# EAGLE design ESP32_Metal_Detector_v1.0 (EAGLE 8.1.1)
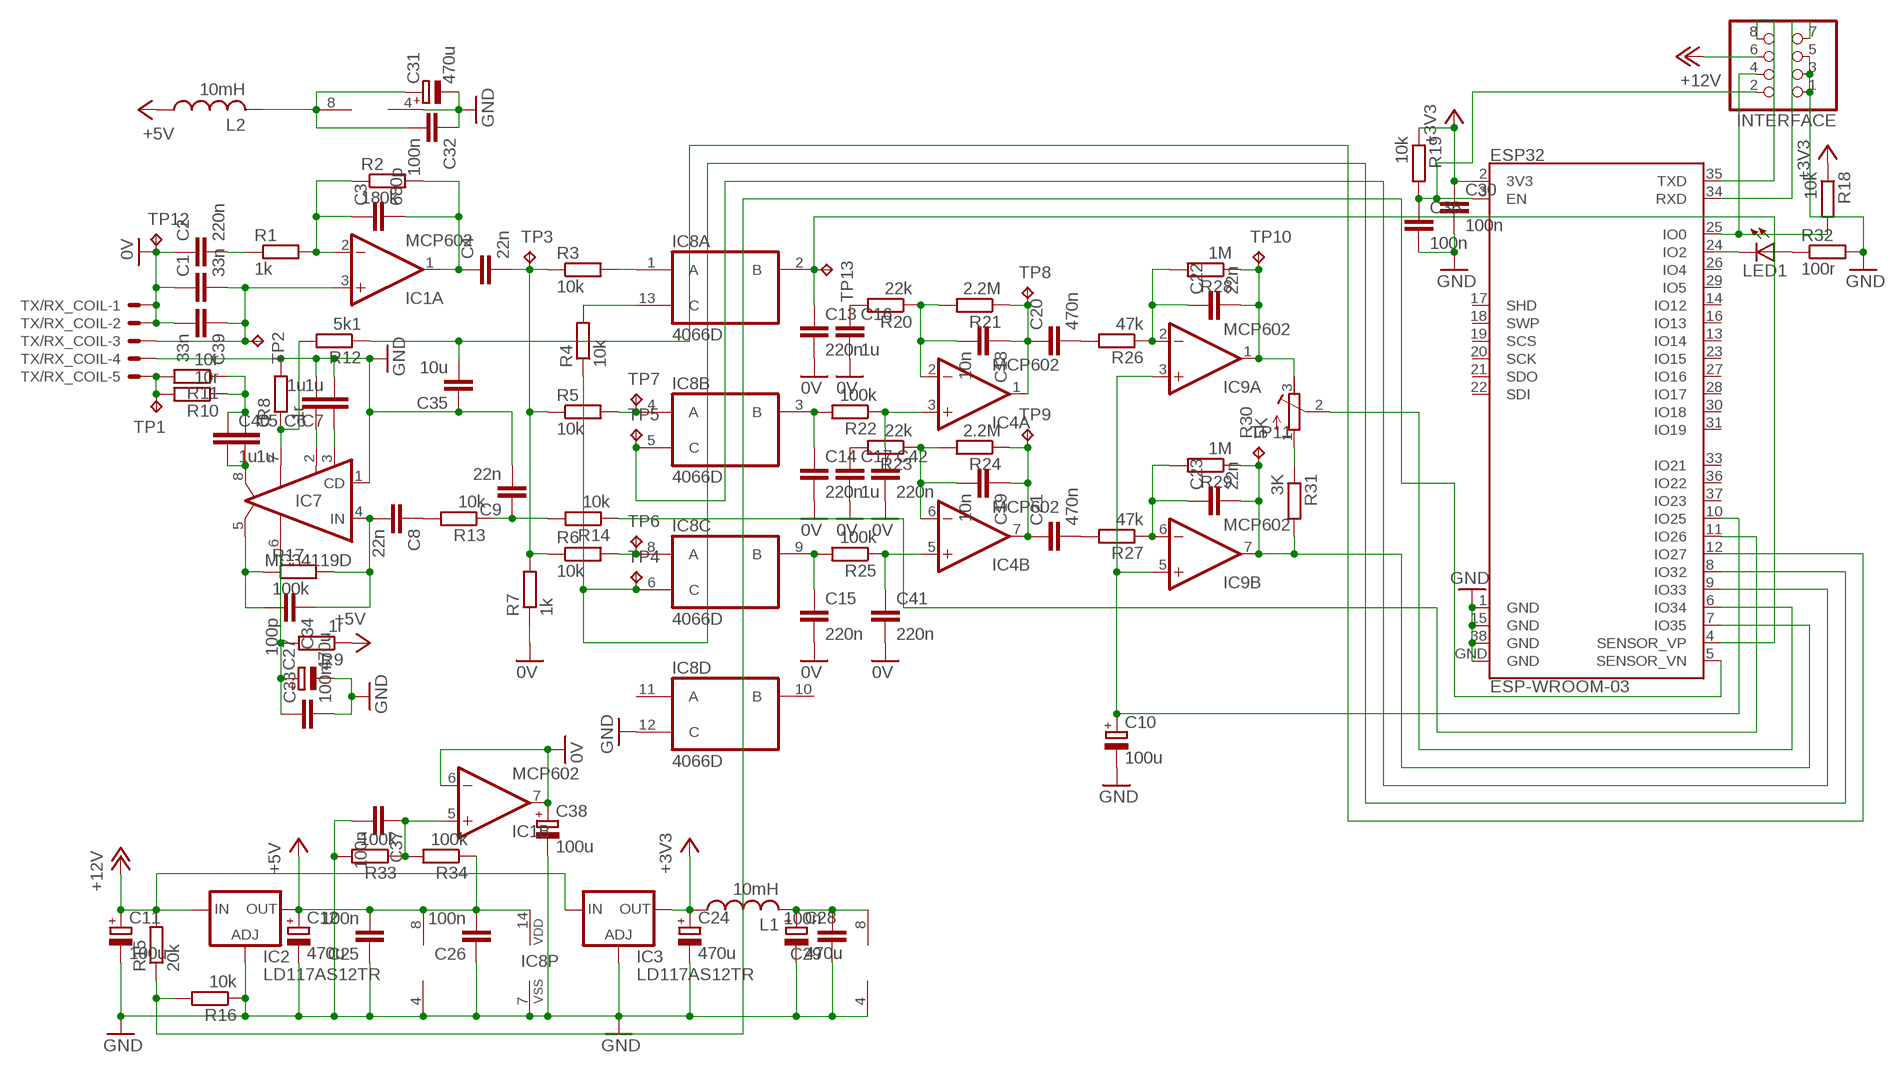
[diagram p0: schematic, sheet 1]

## Parts
C1  33n  C-EU050-055X075  [C050-055X075]
C2  220n  C-EUC1206  [C1206]
C3  680p  C-EUC1206  [C1206]
C4  22n  C-EUC1206  [C1206]
C5  1u  C-EU050-055X075  [C050-055X075]
C6  1u  C-EUC1206  [C1206]
C7  1u  C-EUC1206  [C1206]
C8  22n  C-EUC1206  [C1206]
C9  22n  C-EUC1206  [C1206]
C10  100u  CPOL-EUSMCB  [SMC_B]
C11  100u  CPOL-EUSMCE  [SMC_E]
C12  470u  CPOL-EUSMCD  [SMC_D]
C13  220n  C-EUC1206  [C1206]
C14  220n  C-EUC1206  [C1206]
C15  220n  C-EUC1206  [C1206]
C16  1u  C-EUC1206  [C1206]
C17  1u  C-EUC1206  [C1206]
C18  10n  C-EUC1206  [C1206]
C19  10n  C-EUC1206  [C1206]
C20  470n  C-EUC1206  [C1206]
C21  470n  C-EUC1206  [C1206]
C22  22n  C-EUC1206  [C1206]
C23  22n  C-EUC1206  [C1206]
C24  470u  CPOL-EUSMCD  [SMC_D]
C25  100n  C-EUC1206  [C1206]
C26  100n  C-EUC1206  [C1206]
C27  470u  CPOL-EUSMCD  [SMC_D]
C28  470u  CPOL-EUSMCD  [SMC_D]
C29  100n  C-EUC1206  [C1206]
C30  100n  C-EUC1206  [C1206]
C31  470u  CPOL-EUSMCD  [SMC_D]
C32  100n  C-EUC1206  [C1206]
C33  100n  C-EUC1206  [C1206]
C34  100p  C-EUC1206  [C1206]
C35  10u  C-EUC1206  [C1206]
C36  100n  C-EUC1206  [C1206]
C37  100n  C-EUC1206  [C1206]
C38  100u  CPOL-EUSMCB  [SMC_B]
C39  33n  C-EUC1206  [C1206]
C40  1u  C-EUC1206  [C1206]
C41  220n  C-EUC1206  [C1206]
C42  220n  C-EUC1206  [C1206]
ESP32  ESP-WROOM-03  [ESP-WROOM-03]
IC1  MCP602  LM393D  [SO08]
IC2  LD117AS12TR  [SOT223]
IC3  LD117AS12TR  [SOT223]
IC4  MCP602  LM393D  [SO08]
IC7  MC34119D  [SO08]
IC8  4066D  [SO14]
IC9  MCP602  LM393D  [SO08]
INTERFACE  PINHD-2X4  [2X04]
L1  10mH  L-USL5650M  [L5650M]
L2  10mH  L-USL5650M  [L5650M]
LED1  LEDSML1206  [SML1206]
R1  1k  R-EU_R1206  [R1206]
R2  180k  R-EU_R1206  [R1206]
R3  10k  R-EU_R1206  [R1206]
R4  10k  R-EU_R1206  [R1206]
R5  10k  R-EU_R1206  [R1206]
R6  10k  R-EU_R1206  [R1206]
R7  1k  R-EU_R1206  [R1206]
R8  1r  R-EU_R1206  [R1206]
R9  1r  R-EU_R1206  [R1206]
R10  10r  R-EU_R1206  [R1206]
R11  10r  R-EU_R1206  [R1206]
R12  5k1  R-EU_R1206  [R1206]
R13  10k  R-EU_R1206  [R1206]
R14  10k  R-EU_R1206  [R1206]
R15  20k  R-EU_R1206  [R1206]
R16  10k  R-EU_R1206  [R1206]
R17  100k  R-EU_R1206  [R1206]
R18  10k  R-EU_R1206  [R1206]
R19  10k  R-EU_R1206  [R1206]
R20  22k  R-EU_R1206  [R1206]
R21  2.2M  R-EU_R1206  [R1206]
R22  100k  R-EU_R1206  [R1206]
R23  22k  R-EU_R1206  [R1206]
R24  2.2M  R-EU_R1206  [R1206]
R25  100k  R-EU_R1206  [R1206]
R26  47k  R-EU_R1206  [R1206]
R27  47k  R-EU_R1206  [R1206]
R28  1M  R-EU_R1206  [R1206]
R29  1M  R-EU_R1206  [R1206]
R30  5K  R-TRIMM4G/J  [RTRIM4G/J]
R31  3K  R-EU_R1206  [R1206]
R32  100r  R-EU_R1206  [R1206]
R33  100k  R-EU_R1206  [R1206]
R34  100k  R-EU_R1206  [R1206]
TP1  TPPAD1-13  [P1-13]
TP2  TPPAD1-13  [P1-13]
TP3  TPPAD1-13  [P1-13]
TP4  TPPAD1-13  [P1-13]
TP5  TPPAD1-13  [P1-13]
TP6  TPPAD1-13  [P1-13]
TP7  TPPAD1-13  [P1-13]
TP8  TPPAD1-13  [P1-13]
TP9  TPPAD1-13  [P1-13]
TP10  TPPAD1-13  [P1-13]
TP11  TPPAD1-13  [P1-13]
TP12  TPPAD1-13  [P1-13]
TP13  TPPAD1-13  [P1-13]
TX/RX_COIL  22-23-2051  [22-23-2051]

## Nets
0V: C1.1 C2.1 C13.2 C14.2 C15.2 C16.2 C17.2 C38.+ C39.2 C41.2 C42.2 IC1.6(B:-IN) IC1.7(B:OUT) R7.1 TP12.TP TX/RX_COIL.1 TX/RX_COIL.2
+3V3: C24.+ C30.1 ESP32.2(3V3) IC3.4(OUT) L1.1 R18.1 R19.1
+5V: C12.+ C25.2 C26.2 IC2.4(OUT) IC4.8(P:V+) IC8.14(P:VDD) L2.1 R9.1 R34.1
+12V: C11.+ IC2.3(IN) IC3.3(IN) INTERFACE.6 R15.2
GND: C6.2 C7.2 C9.2 C10.- C11.- C12.- C24.- C25.1 C26.1 C27.- C28.- C29.1 C30.2 C31.- C32.1 C33.2 C35.1 C36.2 C37.2 C38.- ESP32.1(GND) ESP32.15(GND) ESP32.38(GND) ESP32.GND IC1.4(P:V-) IC2.1(ADJ) IC3.1(ADJ) IC4.4(P:V-) IC7.1(CD) IC8.7(P:VSS) IC8.12(D:C) IC9.4(P:V-) INTERFACE.1 INTERFACE.3 INTERFACE.5 R8.2 R16.1 R32.2 R33.2 TX/RX_COIL.4
N$1: C3.2 C4.1 IC1.1(A:OUT) R2.2
N$2: R30.1(A) R31.1
N$3: C1.2 C39.1 IC1.3(A:+IN) TP2.TP TX/RX_COIL.3
N$4: C2.2 R1.1
N$5: C3.1 IC1.2(A:-IN) R1.2 R2.1
N$6: ESP32.8(IO32) IC8.6(C:C) R4.1 TP4.TP
N$7: IC8.1(A:A) R3.2
N$8: IC8.8(C:A) R6.2 TP6.TP
N$9: C4.2 R3.1 R5.1 R6.1 R7.2 TP3.TP
N$10: C22.2 IC9.1(A:OUT) R28.1 R30.3(E) TP10.TP
N$11: IC8.13(A:C) R4.2
N$12: C5.2 C40.2 IC7.8(VO2)
N$13: C5.1 C40.1 R10.1 R11.1
N$14: C15.1 IC8.9(C:B) R25.2
N$15: C27.+ C33.1 IC7.6(VCC) R9.2
N$16: IC7.7(GND) R8.1 R12.2
N$17: C6.1 IC7.2(FC2)
N$18: C7.1 IC7.3(FC1)
N$19: C8.2 C34.1 IC7.4(IN) R17.2
N$20: C8.1 R13.2
N$21: C9.1 R13.1 R14.2
N$22: ESP32.11(IO26) R14.1
N$23: C28.+ C29.2 IC9.8(P:V+) L1.2
N$24: IC8.4(B:A) R5.2 TP7.TP
N$25: C14.1 IC8.3(B:B) R22.2
N$26: ESP32.5(SENSOR_VN) R15.1 R16.2
N$27: ESP32.9(IO33) IC8.5(B:C) TP5.TP
N$28: ESP32.6(IO34) R30.2(S)
N$29: C13.1 ESP32.4(SENSOR_VP) IC8.2(A:B) TP13.TP
N$30: C31.+ C32.2 IC1.8(P:V+) L2.2
N$31: C34.2 IC7.5(VO1) R17.1
N$32: C18.1 C20.1 IC4.1(A:OUT) R21.1 TP8.TP
N$33: C18.2 IC4.2(A:-IN) R20.1 R21.2
N$34: C19.2 IC4.6(B:-IN) R23.1 R24.2
N$35: C35.2 ESP32.12(IO27) R12.1
N$36: C42.1 IC4.3(A:+IN) R22.1
N$37: C41.1 IC4.5(B:+IN) R25.1
N$38: C20.2 R26.2
N$39: C21.2 R27.2
N$40: C23.1 IC9.6(B:-IN) R27.1 R29.2
N$41: C22.1 IC9.2(A:-IN) R26.1 R28.2
N$42: ESP32.25(IO0) INTERFACE.4 R18.2
N$43: C23.2 ESP32.7(IO35) IC9.7(B:OUT) R29.1 R31.2 TP11.TP
N$44: C10.+ ESP32.10(IO25) IC9.3(A:+IN) IC9.5(B:+IN)
N$45: C19.1 C21.1 IC4.7(B:OUT) R24.1 TP9.TP
N$46: LED1.A R32.1
N$47: C36.1 ESP32.3(EN) INTERFACE.2 R19.2
N$48: C16.1 R20.2
N$49: C17.1 R23.2
N$50: R10.2 R11.2 TP1.TP TX/RX_COIL.5
N$51: ESP32.24(IO2) LED1.C
N$52: C37.1 IC1.5(B:+IN) R33.1 R34.2
N$53: ESP32.35(TXD) INTERFACE.8
N$54: ESP32.34(RXD) INTERFACE.7
Unconnected: ESP32.13(IO14) ESP32.14(IO12) ESP32.16(IO13) ESP32.17(SHD) ESP32.18(SWP) ESP32.19(SCS) ESP32.20(SCK) ESP32.21(SDO) ESP32.22(SDI) ESP32.23(IO15) ESP32.26(IO4) ESP32.27(IO16) ESP32.28(IO17) ESP32.29(IO5) ESP32.30(IO18) ESP32.31(IO19) ESP32.33(IO21) ESP32.36(IO22) ESP32.37(IO23) IC8.10(D:B) IC8.11(D:A)

## Library data of the parts
C1 C5 = rcl:C-EU: CAPACITOR, European symbol
C2-C4 C6-C9 C13-C23 C25 C26 C29 C30 C32-C37 C39-C42 = resistor:C-EU: CAPACITOR, European symbol
C10-C12 C24 C27 C28 C31 C38 = rcl:CPOL-EU: POLARIZED CAPACITOR, European symbol
ESP32 = esp32:ESP-WROOM-03
IC1 IC4 IC9 = linear:LM393: COMPARATOR
IC2 IC3 = v-reg:LD117A?*: Low drop fixed and adjustable positive voltage regulators 1 A Source: http://www.st.com/stonline/products/literature/ds/7194/ld1117axx.pdf
IC7 = linear:MC34119: Low Power Audio Amplifier Motorola
IC8 = 40xx:4066: Quad bilateral ANALOG SWITCH
INTERFACE = pinhead:PINHD-2X4: PIN HEADER
L1 L2 = rcl:L-US: INDUCTOR, American symbol
LED1 = led:LED: LED OSRAM: - CHIPLED LG R971, LG N971, LY N971, LG Q971, LY Q971, LO R971, LY R971 LH N974, LH R974 LS Q976, LO Q976, LY Q976 LO Q996 - Hyper CHIPLED LW Q18S LB Q993, LB Q99A, LB R99A - SideLED LS A670, LO A670, LY A670, LG A670, LP A670 LB A673, LV A673, LT A673, LW A673 LH A674 LY A675 LS A676, LA A676, LO A676, LY A676, LW A676 LS A679, LY A679, LG A679 - Hyper Micro SIDELED® LS Y876, LA Y876, LO Y876, LY Y876 LT Y87S - SmartLED LW L88C, LW L88S LB L89C, LB L89S, LG L890 LS L89K, LO L89K, LY L89K LS L896, LA L896, LO L896, LY L896 - TOPLED LS T670, LO T670, LY T670, LG T670, LP T670 LSG T670, LSP T670, LSY T670, LOP T670, LYG T670 LG T671, LOG T671, LSG T671 LB T673, LV T673, LT T673, LW T673 LH T674 LS T676, LA T676, LO T676, LY T676, LB T676, LH T676, LSB T676, LW T676 LB T67C, LV T67C, LT T67C, LS T67K, LO T67K, LY T67K, LW E67C LS E67B, LA E67B, LO E67B, LY E67B, LB E67C, LV E67C, LT E67C LW T67C LS T679, LY T679, LG T679 LS T770, LO T770, LY T770, LG T770, LP T770 LB T773, LV T773, LT T773, LW T773 LH T774 LS E675, LA E675, LY E675, LS T675 LS T776, LA T776, LO T776, LY T776, LB T776 LHGB T686 LT T68C, LB T68C - Hyper Mini TOPLED® LB M676 - Mini TOPLED Santana® LG M470 LS M47K, LO M47K, LY M47K Source: http://www.osram.convergy.de LUXEON: - LUMILED® LXK2-PW12-R00, LXK2-PW12-S00, LXK2-PW14-U00, LXK2-PW14-V00 LXK2-PM12-R00, LXK2-PM12-S00, LXK2-PM14-U00 LXK2-PE12-Q00, LXK2-PE12-R00, LXK2-PE12-S00, LXK2-PE14-T00, LXK2-PE14-U00 LXK2-PB12-K00, LXK2-PB12-L00, LXK2-PB12-M00, LXK2-PB14-N00, LXK2-PB14-P00, LXK2-PB14-Q00 LXK2-PR12-L00, LXK2-PR12-M00, LXK2-PR14-Q00, LXK2-PR14-R00 LXK2-PD12-Q00, LXK2-PD12-R00, LXK2-PD12-S00 LXK2-PH12-R00, LXK2-PH12-S00 LXK2-PL12-P00, LXK2-PL12-Q00, LXK2-PL12-R00 Source: www.luxeon.com KINGBRIGHT: KA-3528ASYC Source: www.kingbright.com
R1-R29 R31-R34 = resistor:R-EU_: RESISTOR, European symbol
R30 = rcl:R-TRIMM: Trimm resistor
TP1-TP13 = testpad:TP: Test pad
TX/RX_COIL = con-molex:22-23-2051: .100" (2.54mm) Center Header - 5 Pin; MF: MOLEX; MPN: 22-23-2051; OC_FARNELL: 1462952; OC_NEWARK: 38C9178

## Board
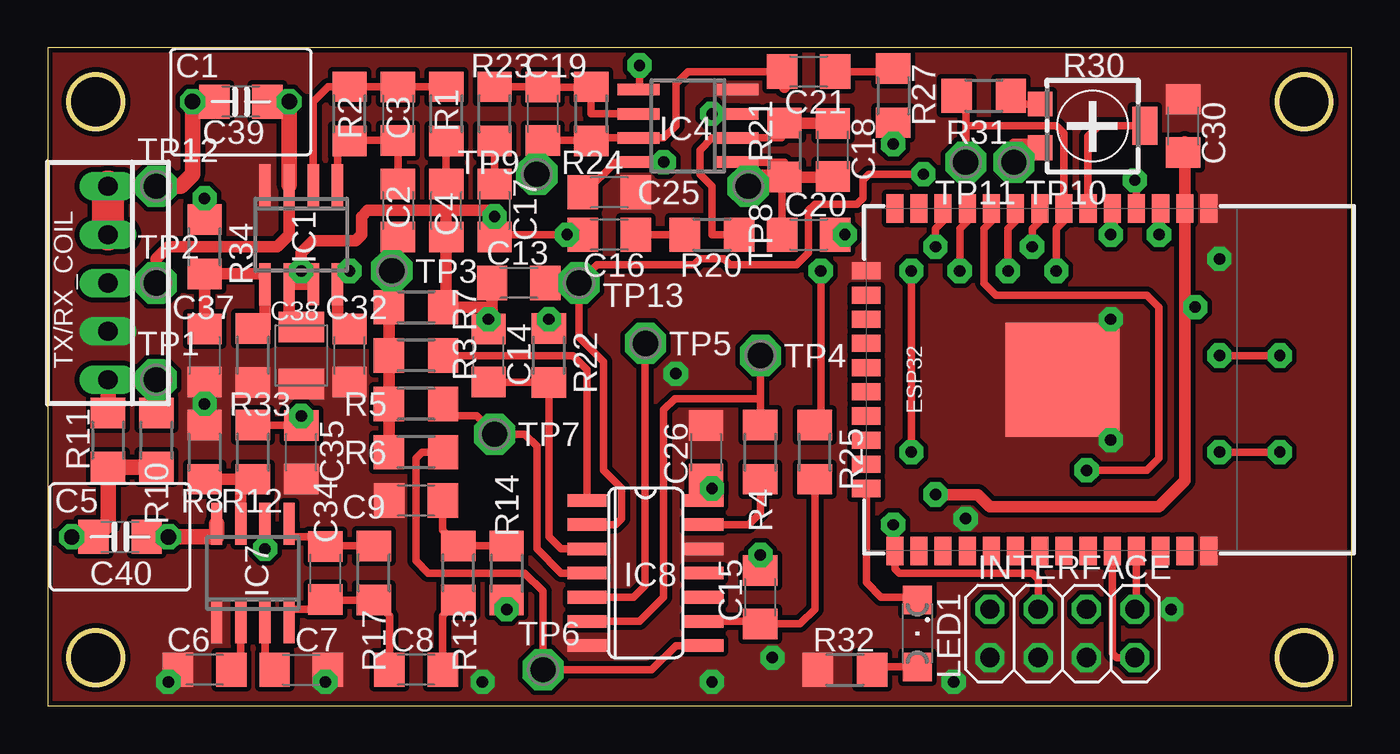
[diagram p1: board, top side]
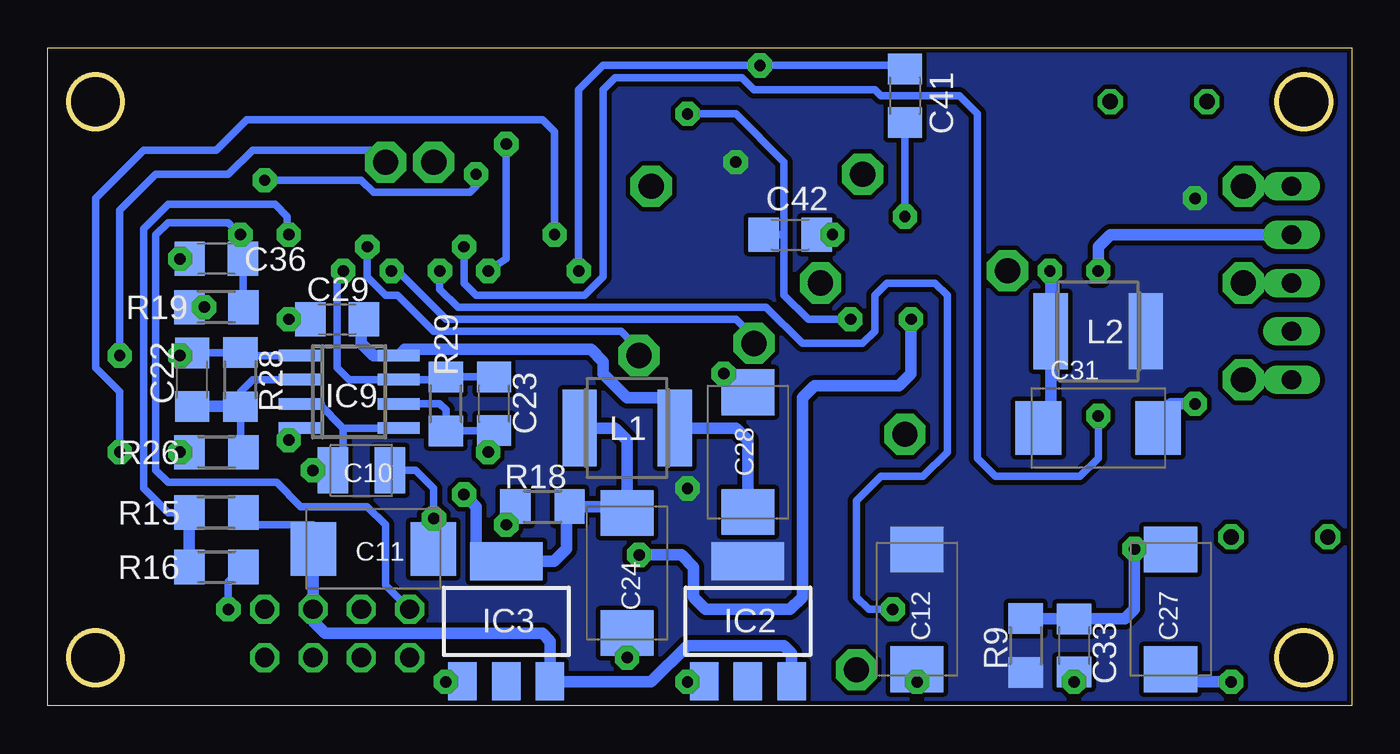
[diagram p2: board, bottom side, seen from below]

Size 68.56 x 34.59 mm. Coordinates in mm from the lower left corner, seen from the top.
Outline: 0,0 68.56,0 68.56,34.59 0,34.59 0,0
Outline: circle at 2.54,2.54 radius 1.42
Outline: circle at 66.04,2.54 radius 1.42
Outline: circle at 66.04,31.75 radius 1.42
Outline: circle at 2.54,31.75 radius 1.42
Copper layers (1*16): Top 0.035mm / dielectric 1.5mm / Bottom 0.035mm
Design rules "ITEADstudio_DRC": minimum track width 6mil, minimum drill 12mil, track to track 6mil, track to pad 6mil, pad to pad 6mil, via to via 6mil, smd to smd 0mil, copper to edge 10mil, drill to drill 10mil, minimum pad ring 10mil, minimum via ring 6mil, stop-mask expansion 2mil, vias tented up to drill 100mil, thermal gap 10mil

### Footprints (pad centres in the part's own frame; a part is rotated, then mirrored left to right if it is on the bottom)
C050-055X075 = drill 0.813 octagon: 1 -2.54,0; 2 2.54,0
C1206 = smd 1.6 x 1.8: 1 -1.4,0; 2 1.4,0
SMC_B = smd 1.6 x 2.4: + -1.5,0; - 1.5,0
SMC_E = smd 2.4 x 2.8: + -3.15,0; - 3.15,0
SMC_D = smd 2.4 x 2.8: + -3.15,0; - 3.15,0
ESP-WROOM-03 = smd 0.9 x 1.5: 1 7.7,9; 2 6.43,9; 3 5.16,9; 4 3.89,9; 5 2.62,9; 6 1.35,9; 7 0.08,9; 8 -1.19,9; 9 -2.46,9; 10 -3.73,9; 11 -5,9; 12 -6.27,9; 13 -7.54,9; 14 -8.81,9; 25 -8.81,-9; 26 -7.54,-9; 27 -6.27,-9; 28 -5,-9; 29 -3.73,-9; 30 -2.46,-9; 31 -1.19,-9; 32 0.08,-9; 33 1.35,-9; 34 2.62,-9; 35 3.89,-9; 36 5.16,-9; 37 6.43,-9; 38 7.7,-9 | smd 1.5 x 0.9: 15 -10.3,5.715; 16 -10.3,4.445; 17 -10.3,3.175; 18 -10.3,1.905; 19 -10.3,0.635; 20 -10.3,-0.635; 21 -10.3,-1.905; 22 -10.3,-3.175; 23 -10.3,-4.445; 24 -10.3,-5.715 | smd 6 x 6: GND 0,0
SO08 = smd 0.6 x 2.2: 1 -1.905,-2.6; 2 -0.635,-2.6; 3 0.635,-2.6; 4 1.905,-2.6; 5 1.905,2.6; 6 0.635,2.6; 7 -0.635,2.6; 8 -1.905,2.6
SOT223 = smd 1.5 x 2: 1 -2.3,-3.15; 2 0,-3.15; 3 2.3,-3.15 | smd 3.8 x 2: 4 0,3.15
SO14 = smd 0.66 x 2.032: 1 -3.81,-3.073; 2 -2.54,-3.073; 3 -1.27,-3.073; 4 0,-3.073; 5 1.27,-3.073; 6 2.54,-3.073; 7 3.81,-3.073; 8 3.81,3.073; 9 2.54,3.073; 10 1.27,3.073; 11 0,3.073; 12 -1.27,3.073; 13 -2.54,3.073; 14 -3.81,3.073
2X04 = drill 1.016 octagon: 1 -3.81,-1.27; 2 -3.81,1.27; 3 -1.27,-1.27; 4 -1.27,1.27; 5 1.27,-1.27; 6 1.27,1.27; 7 3.81,-1.27; 8 3.81,1.27
L5650M = smd 1.8 x 4: 1 -2.5,0; 2 2.5,0
SML1206 = smd 1.5 x 1.5: A 1.75,0; C -1.75,0
R1206 = smd 1.6 x 1.803: 1 -1.422,0; 2 1.422,0
RTRIM4G/J = smd 1.3 x 1.3: 1 -1.15,-2.75; 3 1.15,-2.75 | smd 2 x 1.3: 2 0,2.75
P1-13 = drill 1.321 pad 2.159 octagon: TP 0,0
22-23-2051 = drill 1 long: 1 -5.08,0; 2 -2.54,0; 3 0,0; 4 2.54,0; 5 5.08,0

### Placement (x,y rotation side)
C1  10.16,31.75 0 top
C2  20.95,26.04 90 top
C3  18.41,31.11 270 top
C4  18.41,26.04 270 top
C5  3.81,8.89 0 top
C6  8.26,1.91 180 top
C7  13.34,1.91 0 top
C8  19.37,1.91 180 top
C9  19.37,10.79 180 top
C10  52.07,12.38 0 bottom
C11  51.44,8.26 0 bottom
C12  22.86,5.08 270 bottom
C13  24.77,22.23 180 top
C14  23.18,18.41 90 top
C15  37.47,5.71 90 top
C16  29.53,24.77 180 top
C17  23.5,26.04 270 top
C18  41.27,29.21 90 top
C19  26.04,31.11 90 top
C20  40.01,24.77 0 top
C21  40.01,33.34 0 top
C22  60.96,17.14 90 bottom
C23  45.09,15.88 90 bottom
C24  38.1,6.99 270 bottom
C25  29.53,26.99 180 top
C26  34.61,13.34 270 top
C27  9.53,5.08 270 bottom
C28  31.75,13.34 90 bottom
C29  53.34,20.32 0 bottom
C30  59.69,30.48 90 top
C31  13.34,14.61 0 bottom
C32  15.88,18.41 90 top
C33  14.61,3.17 270 bottom
C34  14.61,6.99 90 top
C35  13.34,13.34 90 top
C36  59.69,23.5 180 bottom
C37  8.26,18.41 270 top
C38  13.34,18.41 270 top
C39  10.16,31.75 180 top
C40  3.81,8.89 0 top
C41  23.5,32.07 270 bottom
C42  29.53,24.77 0 bottom
ESP32  53.34,17.14 0 top
IC1  13.34,24.77 180 top
IC2  31.75,4.45 0 bottom
IC3  44.45,4.45 0 bottom
IC4  33.66,30.48 90 top
IC7  10.79,6.99 0 top
IC8  31.43,6.99 270 top
IC9  52.7,16.51 270 bottom
INTERFACE  53.34,3.81 0 top
L1  38.1,14.61 0 bottom
L2  13.34,19.68 180 bottom
LED1  45.72,3.81 270 top
R1  20.95,31.11 90 top
R2  15.88,31.11 270 top
R3  19.37,18.41 0 top
R4  37.47,13.34 270 top
R5  19.37,15.88 0 top
R6  19.37,13.34 0 top
R7  19.37,20.95 180 top
R8  8.26,13.34 90 top
R9  17.14,3.17 90 bottom
R10  5.71,13.97 90 top
R11  3.17,13.97 90 top
R12  10.79,13.34 270 top
R13  21.59,6.99 270 top
R14  24.13,6.99 90 top
R15  59.69,10.16 0 bottom
R16  59.69,7.3 180 bottom
R17  17.14,6.99 270 top
R18  42.55,10.48 180 bottom
R19  59.69,20.95 0 bottom
R20  34.92,24.77 180 top
R21  38.73,29.21 90 top
R22  26.35,18.41 270 top
R23  23.5,31.11 270 top
R24  28.57,31.11 90 top
R25  40.32,13.34 270 top
R26  59.69,13.34 180 bottom
R27  44.45,32.07 90 top
R28  58.42,17.14 270 bottom
R29  47.62,15.88 270 bottom
R30  54.93,30.48 270 top
R31  49.21,32.07 180 top
R32  41.91,1.91 180 top
R33  10.79,18.41 270 top
R34  8.26,24.13 270 top
TP1  5.71,17.14 0 top
TP2  5.71,22.23 0 top
TP3  18.1,22.86 0 top
TP4  37.47,18.41 0 top
TP5  31.43,19.05 0 top
TP6  26.04,1.91 0 top
TP7  23.5,14.29 0 top
TP8  36.83,27.3 0 top
TP9  25.72,27.94 90 top
TP10  50.8,28.57 90 top
TP11  48.26,28.57 90 top
TP12  5.71,27.3 0 top
TP13  27.94,22.23 0 top
TX/RX_COIL  3.17,22.23 270 top

### Tracks (layer width: path | path; a pad name or v marks a point on that pad's centre or on a via)
0V  (via drill 0.6 pad 1.27)
  Top 0.152: v23.18,20.32 23.36,21.59
  Top 0.406: v27.3,24.77 C42.2 23.62,24.77 arc90 C17.2
  Top 0.61: 21.11,25.12 arc90 C2.1 | 13.34,22.16 IC1.7 | 13.34,22.16 IC1.6 12.7,19.91 C38.+ | 13.34,22.16 v13.34,22.86 13.34,23.81 13.97,24.45 16.19,24.45 16.51,24.77 16.51,25.72 16.83,26.04 20.95,26.04 | 20.95,26.04 C2.1 | C13.2 23.36,21.59 23.36,20.95 | 23.36,20.95 23.36,20.58 C14.2 | C17.2 v23.5,25.72 23.5,26.04 20.95,26.04 | C15.2 v37.47,7.94 | 23.36,20.95 R7.1 20.95,21.12 C2.1
  Top 0.813: TX/RX_COIL.1 TP12.TP 6.99,27.3 7.62,27.94 C1.1 C39.2
  Top 1.676: TX/RX_COIL.2 TX/RX_COIL.1
  Bottom 0.406: C42.2 v27.3,24.77 | C41.2 v23.5,25.72
  Bottom 0.61: v13.34,22.86 13.34,24.13 12.7,24.77 TX/RX_COIL.2 | v23.18,20.32 23.18,17.46 23.81,16.83 28.26,16.83 28.89,16.19 28.89,5.71 29.53,5.08 33.97,5.08 34.61,5.71 34.61,7.3 35.24,7.94 v37.47,7.94
+3V3  (via drill 0.6 pad 1.27)
  Top 0.61: 59.77,21.51 ESP32.2 59.77,29.64 C30.1 | 59.77,21.51 v60.33,20.95 | 59.77,21.51 59.77,11.83 58.42,10.48 49.53,10.48 48.9,11.11 v46.67,11.11
  Bottom 0.61: R19.1 v60.33,20.95 | C24.+ 38.1,13.97 38.73,14.61 L1.1 40.64,14.56 40.64,13.97 | 38.12,10.16 C24.+ | C24.+ 38.44,10.48 R18.1 41.27,10.31 41.27,8.26 41.94,7.59 IC3.4 45.7,7.59 45.72,7.62 46.04,7.62 46.04,10.48 v46.67,11.11
+5V  (via drill 0.6 pad 1.27)
  Top 0.152: C26.2 35.05,11.3 v34.92,11.43 | IC4.8 v32.38,28.57
  Top 0.406: C25.2 28.26,26.99 29.84,28.57 IC4.8
  Top 0.61: R34.1 v8.26,26.67 | C26.2 34.92,11.21 IC8.14
  pour Bottom (isolate 0.254, no thermals): 0,34.29 68.58,34.29 68.58,0 0,0
+12V
  Bottom 0.406: R15.2 57.63,9.53 54.61,9.53 54.59,9.18 C11.+
  Bottom 0.61: IC2.3 29.45,2.78 29.84,3.17 34.92,3.17 36.83,1.27 42.12,1.27 IC3.3 42.15,3.42 42.55,3.81 53.98,3.81 54.61,4.45 INTERFACE.6 54.61,8.23 C11.+ 54.61,8.28
GND  (via drill 0.6 pad 1.27, 0.61 pad 1.27)
  Bottom 0.152: C33.2 14.61,1.91
  Bottom 0.406: v59.05,5.08 59.05,6.52 R16.1 | C10.- 49.21,12.38 48.26,11.43 v48.26,9.84
  Bottom 0.61: C36.2 v61.59,23.5 | C27.- 9.5,1.27 v6.35,1.27 | v8.26,15.88 9.53,15.88 10.19,15.21 C31.- | C12.- v22.86,1.27 | IC2.1 34.29,1.53 v34.92,1.27 | IC3.1 46.99,1.53 v47.62,1.27 | C28.- v33.02,17.46 | C24.- v38.1,2.54 | v14.61,1.27 C33.2 | v48.26,9.84 48.26,8.28 C11.- | IC9.4 55.94,14.03 v55.88,13.97 | C29.1 v55.88,20.32
  pour Top (isolate 0.254, no thermals): 0,34.29 0.64,34.29 68.58,34.29 68.58,0 0,0
N$1
  Top 0.406: 15.9,29.71 C3.2 C4.1 | R2.2 15.24,29.06 IC1.1
  Top 0.61: 15.9,29.71 R2.2
N$2
  Top 0.406: R30.1 50.92,31.63 50.48,32.07 50.48,32.22 R31.1
N$3
  Top 0.61: IC1.3 12.7,24.77 12.06,24.13 6.35,24.13 5.71,23.5 TP2.TP
  Top 0.813: IC1.3 C1.2 C39.1 | TP2.TP TX/RX_COIL.3
N$4
  Top 0.406: R1.1 C2.2
N$5
  Top 0.406: IC1.2 13.97,31.75 14.76,32.54 R2.1 18.39,32.54 | 18.44,32.54 R1.2
  Top 0.61: 18.39,32.54 C3.1 18.44,32.54
N$6  (via drill 0.6 pad 1.27)
  Top 0.406: 37.47,16.19 R4.1 | 37.47,16.19 TP4.TP | IC8.6 31.11,4.45 32.38,5.71 32.38,15.56 32.98,16.15 37.43,16.15 37.47,16.19 | ESP32.8 52.15,25.48 51.75,25.08 v51.75,24.13
  Top 0.61: 37.29,14.44 R4.1
  Bottom 0.406: TP4.TP 37.47,18.73 38.42,19.68 48.26,19.68 50.16,21.59 50.8,21.59 51.75,22.54 v51.75,24.13
N$7
  Top 0.406: IC8.1 28.36,17.68 27.62,18.41 R3.2
N$8
  Top 0.406: IC8.8 33.02,3.17 31.75,1.91 TP6.TP 26.04,6.03 25.08,6.99 20,6.99 19.37,7.62 19.37,13.02 19.68,13.34 R6.2
N$9
  Top 0.254: TP3.TP 18.26,23.5
  Top 0.61: C4.2 18.26,25.12 18.26,23.5 R7.2 R3.1 R5.1 R6.1
N$10  (via drill 0.6 pad 1.27)
  Top 0.406: v61.59,18.41 v64.77,18.41
  Top 0.61: R30.3 51.98,29.53 50.8,29.53 TP10.TP
  Bottom 0.406: IC9.1 58.27,18.41 | R28.1 60.94,18.57 | v64.77,18.41 64.77,26.04 62.87,27.94 59.05,27.94 57.78,29.21 51.44,29.21 TP10.TP
  Bottom 0.61: 58.27,18.41 R28.1 | 60.94,18.57 C22.2 61.47,18.55 v61.59,18.41
N$11
  Top 0.406: IC8.13 36.83,9.53 37.47,10.16 R4.2
N$12
  Top 0.813: IC7.8 8.89,8.89 C5.2 C40.2
N$13
  Top 0.813: R10.1 R11.1 3.17,9.53 2.54,8.89 C40.1 C5.1
N$14
  Top 0.406: IC8.9 37.02,4.45 C15.1 39.56,4.32 40.32,5.08 R25.2
N$15  (via drill 0.6 pad 1.27)
  Top 0.61: IC7.6 v11.43,8.26
  Bottom 0.61: C27.+ 9.55,8.26 v11.43,8.26 11.43,5.08 11.94,4.58 C33.1 17.12,4.58 R9.2
N$16
  Top 0.61: 10.16,11.91 R8.1 | 10.16,11.91 R12.2 | IC7.7 10.16,11.91
N$17
  Top 0.406: IC7.2 10.16,2.41 C6.1
N$18
  Top 0.406: IC7.3 11.43,2.41 C7.1
N$19
  Top 0.406: C8.2 17.97,4.74 R17.2 14.61,5.56 C34.1 14.61,5.08 12.7,5.08
  Top 0.61: 12.7,5.08 IC7.4 | R17.2 17.12,5.58
N$20
  Top 0.406: C8.1 20.77,4.74 R13.2
N$21
  Top 0.406: R14.2 R13.1 20.77,9.23 C9.1
  Top 0.61: R13.1 21.09,8.54
N$22  (via drill 0.6 pad 1.27)
  Top 0.406: ESP32.11 48.34,25.48 47.94,25.08 v47.94,22.86
  Top 0.61: v24.13,5.08 R14.1
  Bottom 0.406: v24.13,5.08 25.4,5.08 26.04,5.71 26.04,10.79 24.77,12.06 22.54,12.06 21.27,13.34 21.27,21.59 21.91,22.23 24.45,22.23 25.08,21.59 25.08,19.68 25.72,19.05 28.89,19.05 30.8,20.95 46.99,20.95 47.94,21.91 v47.94,22.86
N$23
  Bottom 0.61: C28.+ 31.75,13.97 32.38,14.61 L1.2 35.6,16.15 35.56,16.19 38.1,16.19 39.37,17.46 39.37,18.1 40.01,18.73 49.79,18.73 IC9.8 | 50.8,18.41 IC9.8 | 51.44,20.19 C29.2 52.07,20.19 52.07,19.05 51.44,18.41 IC9.8
N$24
  Top 0.406: 28.57,6.99 IC8.4 26.99,6.99 25.72,8.26 25.72,13.65 25.08,14.29 TP7.TP 22.54,15.24 20.95,15.24 20.79,15.4 R5.2
N$25
  Top 0.406: IC8.3 26.99,8.26 26.35,8.89 R22.2 26.65,17.02 C14.1
  Top 0.61: 23.52,16.99 C14.1
N$26  (via drill 0.6 pad 1.27)
  Top 0.61: ESP32.5 55.96,24.84 v55.88,24.77
  Bottom 0.406: 55.96,24.84 55.96,25.72 56.59,26.35 62.23,26.35 63.5,25.08 63.5,11.43 62.23,10.16 R15.1
  Bottom 0.61: 55.96,24.84 v55.88,24.77 | R15.1 R16.2
N$27  (via drill 0.6 pad 1.27)
  Top 0.406: IC8.5 30.8,5.71 31.41,6.33 31.41,19.02 TP5.TP | ESP32.9 50.88,25.48 50.48,25.08 v50.48,22.86
  Bottom 0.406: TP5.TP 31.43,19.37 32.38,20.32 47.62,20.32 50.16,22.86 v50.48,22.86
N$28
  Top 0.406: ESP32.6 54.69,29.93 55.24,30.48 R30.2
N$29  (via drill 0.6 pad 1.27)
  Top 0.406: ESP32.4 57.23,27.86 | IC8.2 29.84,9.53 30.16,9.84 30.16,11.43 29.21,12.38 29.21,18.1 27.94,19.37 TP13.TP 28.89,23.18 33.97,23.18 34.29,23.5 35.56,23.5 35.88,23.18 39.37,23.18 40.01,23.81 40.01,26.04 40.32,26.35 42.55,26.35 42.86,26.67 42.86,27.62 43.18,27.94 v46.04,27.94
  Top 0.61: TP13.TP C13.1 | 57.23,27.86 v57.15,27.62
  Bottom 0.406: v57.15,27.62 52.07,27.62 51.44,26.99 46.35,26.99 46.04,27.3 v46.04,27.94
N$30  (via drill 0.6 pad 1.27)
  Top 0.61: C32.2 15.24,20.45 IC1.8 15.24,22.86 v15.88,22.86
  Bottom 0.61: v15.88,22.86 15.84,22.82 L2.2 15.84,15.26 C31.+
N$31
  Top 0.406: IC7.5 12.7,8.89 14.29,8.89 14.29,8.38 C34.2 14.61,8.41 R17.1
  Top 0.61: 12.7,8.89 IC7.5 | R17.1 17.12,8.38
N$32
  Top 0.152: 38.58,27.3 R21.1
  Top 0.406: IC4.1 38.73,28.57 R21.1 38.6,27.02 C20.1
  Top 0.61: R21.1 41.25,27.79 C18.1
  Top 0.813: R21.1 37.31,27.79 TP8.TP
N$33
  Top 0.406: R21.2 38.58,29.84 IC4.2 34.92,29.84 34.29,29.21 34.29,27.94 34.92,27.3 34.92,24.77 R20.1
  Top 0.61: R21.2 41.25,30.63 C18.2
N$34
  Top 0.406: R23.1 26.01,32.54 | C19.2 28.55,32.52 | IC4.6 28.57,31.11 R24.2
  Top 0.61: 26.01,32.54 C19.2 | R24.2 28.55,32.52
N$35  (via drill 0.6 pad 1.27)
  Top 0.406: R12.1 13.34,14.76 | ESP32.12 47.07,25.48 46.67,25.08 v46.67,24.13
  Top 0.61: 13.34,14.76 C35.2 v13.34,15.24
  Bottom 0.406: v13.34,15.24 13.34,13.02 14.29,12.06 18.73,12.06 19.68,13.02 19.68,31.11 20.64,32.07 24.77,32.07 25.08,32.38 31.43,32.38 32.07,33.02 38.73,33.02 39.37,32.38 39.37,22.54 40.32,21.59 46.04,21.59 46.67,22.23 v46.67,24.13
N$36  (via drill 0.6 pad 1.27)
  Top 0.61: IC4.3 v34.92,31.11 | R22.1 v26.35,20.32
  Bottom 0.406: v34.92,31.11 32.38,31.11 29.84,28.57 29.84,24.77 | 29.84,24.77 29.84,21.59 28.57,20.32 v26.35,20.32 | C42.1 29.84,24.77
N$37  (via drill 0.6 pad 1.27)
  Top 0.406: v31.11,33.66 31.11,32.45 IC4.5 | v40.64,22.86 40.64,15.07 R25.1
  Bottom 0.406: v40.64,22.86 40.64,32.38 39.37,33.66 v31.11,33.66 23.68,33.66 C41.1
N$38  (via drill 0.6 pad 1.27)
  Top 0.406: v64.77,13.34 v61.59,13.34
  Top 0.813: C20.2 v41.91,24.77
  Bottom 0.406: v64.77,13.34 64.77,16.51 66.04,17.78 66.04,26.67 63.5,29.21 59.69,29.21 58.1,30.8 42.55,30.8 41.91,30.16 v41.91,24.77
  Bottom 0.61: R26.2 v61.59,13.34
N$39
  Top 0.406: C21.2 44.62,33.34
  Top 0.61: 44.62,33.34 R27.2
N$40  (via drill 0.6 pad 1.27)
  Top 0.406: v45.4,22.86 v45.4,13.34
  Top 0.61: R27.1 v44.45,29.53
  Bottom 0.406: v44.45,29.53 44.45,23.5 v45.4,22.86 | IC9.6 47.94,15.88 47.62,15.56 R29.2 45.72,14.45 | 45.72,14.45 45.11,14.45 C23.1 | v45.4,13.34 45.4,14.14 45.72,14.45
N$41
  Bottom 0.406: IC9.2 57.78,17.14 58.42,16.51 R28.2 58.42,13.49
  Bottom 0.61: R28.2 58.44,15.74 C22.1 61.11,15.59 | R26.1 58.42,13.49
N$42  (via drill 0.6 pad 1.27)
  Top 0.406: INTERFACE.4 52.07,6.67 51.75,6.99 44.77,6.99 44.53,7.22 ESP32.25 44.45,8.22 v44.45,9.53
  Bottom 0.61: R18.2 v44.45,9.53
N$43  (via drill 0.6 pad 1.27)
  Top 0.406: 47.31,32.23 R31.2 48.26,32.07 48.26,30.48 | v53.02,22.86 53.02,25.08 53.42,25.48 ESP32.7 53.42,30.08 53.02,30.48 48.26,30.48 | TP11.TP 48.26,30.16 48.26,30.48
  Bottom 0.406: C23.2 45.11,17.3 R29.1 47.78,17.14 IC9.7 52.7,17.14 53.34,17.78 53.34,22.54 v53.02,22.86
  Bottom 0.61: 47.62,17.14 R29.1
N$44  (via drill 0.6 pad 1.27)
  Top 0.406: ESP32.10 49.61,25.48 49.21,25.08 49.21,22.23 49.85,21.59 57.78,21.59 58.42,20.95 58.42,13.02 57.78,12.38 v54.61,12.38
  Bottom 0.406: 54.29,15.88 53.02,14.61 | 53.02,14.61 IC9.5 | 53.02,14.61 53.02,12.93 C10.+
  Bottom 0.61: IC9.3 54.29,15.88 | C10.+ v54.61,12.38
N$45
  Top 0.406: 28.73,29.84 IC4.7 32.38,29.84 33.02,30.48 33.02,32.7 33.66,33.34 38.1,33.34 | 28.55,29.71 C19.1
  Top 0.61: 28.73,29.84 R24.1 28.55,29.71 | 38.1,33.34 38.73,33.02 38.73,32.52 C21.1 | C19.1 25.72,29.71 TP9.TP
N$46
  Top 0.406: LED1.A 43.49,2.06
  Top 0.61: 43.49,2.06 R32.1
N$47  (via drill 0.6 pad 1.27)
  Top 0.61: ESP32.3 v58.42,24.77
  Bottom 0.406: R19.2 58.27,23.47 | INTERFACE.2 50.8,6.35 50.8,9.53 51.75,10.48 55.24,10.48 56.52,11.75 62.23,11.75 62.87,12.38 62.87,24.77 62.23,25.4 59.05,25.4 v58.42,24.77
  Bottom 0.61: 58.27,23.47 C36.1 58.42,23.62 v58.42,24.77
N$48
  Top 0.406: C16.1 R20.2
N$49
  Top 0.406: R23.2 C17.1
N$50
  Top 0.813: R11.2 TX/RX_COIL.5 TP1.TP R10.2
N$51
  Top 0.406: ESP32.24 43.04,6.49 43.81,5.71 45.56,5.71
  Top 0.61: 45.56,5.71 LED1.C
N$52
  Top 0.61: C37.1 R34.2 11.43,22.71 IC1.5 11.43,19.84 R33.1
N$53
  Top 0.406: ESP32.35 57.23,5.16 INTERFACE.8
N$54
  Top 0.406: ESP32.34 55.96,2.78 56.2,2.54 INTERFACE.7